# Altium schematic sheet wifi.SchDoc
size A
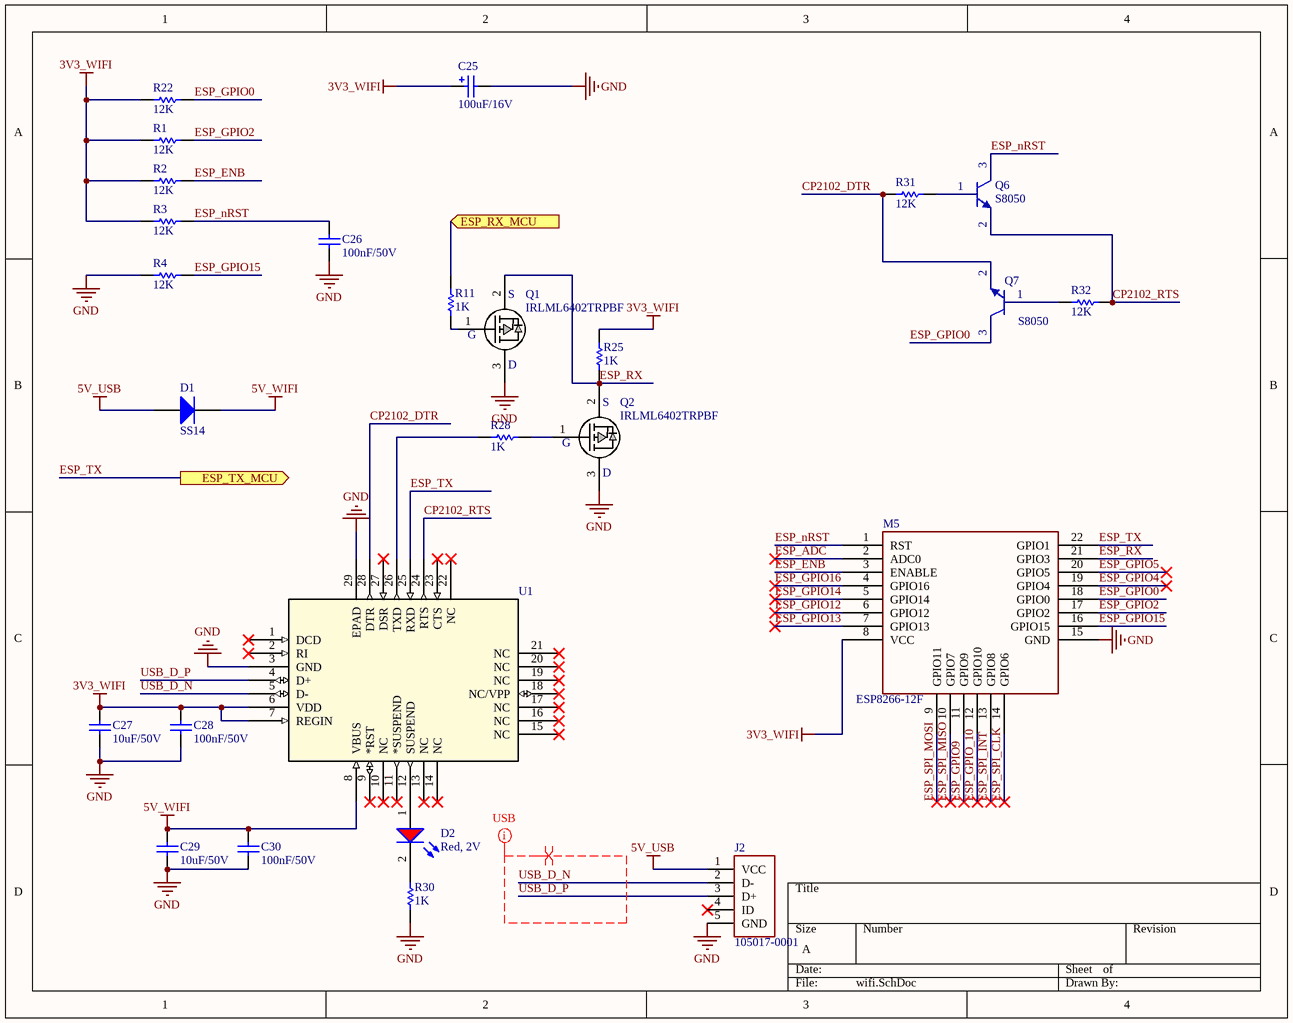
[diagram p0: wifi.SchDoc]

## Parts
C25  value 100uF/16V  [CAP_SM_TAN]  (hidden comment: TAJB107M006RNJ)
C26  value 100nF/50V  [CAP-SM-0805]  (hidden comment: Cap-100nF-50V-0805)
C27  value 10uF/50V  [CAP-SM-0805]  (hidden comment: Cap-10uF-50V-0805)
C28  value 100nF/50V  [CAP-SM-0805]  (hidden comment: Cap-100nF-50V-0805)
C29  value 10uF/50V  [CAP-SM-0805]  (hidden comment: Cap-10uF-50V-0805)
C30  value 100nF/50V  [CAP-SM-0805]  (hidden comment: Cap-100nF-50V-0805)
D1  SS14  [SS14]
D2  value Red, 2V  [LED_0805_Blue]  (hidden comment: LED-RED-TH-3mm)
J2  105017-0001  [CONN_105017-0001]
M5  ESP8266-12F  [ESP8266-12F]
Q1  IRLML6402TRPBF  [SOT23_NEX]
Q2  IRLML6402TRPBF  [SOT23_NEX]
Q6  S8050  [SOT23_NEX]
Q7  S8050  [SOT23_NEX]
R1  value 12K  [RES-SM-0805]  (hidden comment: Res-12K-0805)
R2  value 12K  [RES-SM-0805]  (hidden comment: Res-12K-0805)
R3  value 12K  [RES-SM-0805]  (hidden comment: Res-12K-0805)
R4  value 12K  [RES-SM-0805]  (hidden comment: Res-12K-0805)
R11  value 1K  [RES-SM-0805]  (hidden comment: Res-1K-0805)
R22  value 12K  [RES-SM-0805]  (hidden comment: Res-12K-0805)
R25  value 1K  [RES-SM-0805]  (hidden comment: Res-1K-0805)
R28  value 1K  [RES-SM-0805]  (hidden comment: Res-1K-0805)
R30  value 1K  [RES-SM-0805]  (hidden comment: Res-1K-0805)
R31  value 12K  [RES-SM-0805]  (hidden comment: Res-12K-0805)
R32  value 12K  [RES-SM-0805]  (hidden comment: Res-12K-0805)
U1  (no value)  [CP2102-GM]

## Ports
ESP_RX_MCU (in), ESP_TX_MCU (out)

## Nets
3V3_WIFI: C25.1 C27.2 C28.2 M5.8(VCC) R1.1 R2.1 R3.1 R22.1 R25.1 U1.6(VDD) U1.7(REGIN)
5V_USB: D1.2(A) J2.1(VCC)
5V_WIFI: C29.2 C30.2 D1.1(K) U1.8(VBUS)
GND: C25.2 C26.1 C27.1 C28.1 C29.1 C30.1 J2.5(GND) M5.15(GND) Q1.3(D) Q2.3(D) R4.1 R30.1 U1.3(GND) U1.29(EPAD)
CP2102_DTR: Q7.2(E) R31.1 U1.28(DTR)
CP2102_RTS: Q6.2(E) R32.2 U1.24(RTS)
ESP_ADC: M5.2(ADC0)
ESP_ENB: M5.3(ENABLE) R2.2
ESP_GPIO0: M5.18(GPIO0) Q7.3(C) R22.2
ESP_GPIO2: M5.17(GPIO2) R1.2
ESP_GPIO4: M5.19(GPIO4)
ESP_GPIO5: M5.20(GPIO5)
ESP_GPIO9: M5.11(GPIO9)
ESP_GPIO12: M5.6(GPIO12)
ESP_GPIO13: M5.7(GPIO13)
ESP_GPIO14: M5.5(GPIO14)
ESP_GPIO15: M5.16(GPIO15) R4.2
ESP_GPIO16: M5.4(GPIO16)
ESP_GPIO_10: M5.12(GPIO10)
ESP_nRST: C26.2 M5.1(RST) Q6.3(C) R3.2
ESP_RX: M5.21(GPIO3) Q1.2(S) Q2.2(S) R25.2
ESP_RX_MCU: R11.2 ; port ESP_RX_MCU
ESP_SPI_CLK: M5.14(GPIO6)
ESP_SPI_INT: M5.13(GPIO8)
ESP_SPI_MISO: M5.10(GPIO7)
ESP_SPI_MOSI: M5.9(GPIO11)
ESP_TX: M5.22(GPIO1) U1.25(RXD) ; port ESP_TX_MCU
USB_D_N: J2.2(D-) U1.5(D-)
USB_D_P: J2.3(D+) U1.4(D+)
NetD2_1: D2.1(A) U1.12(SUSPEND)
NetD2_2: D2.2(K) R30.2
NetQ1_1: Q1.1(G) R11.1
NetQ2_1: Q2.1(G) R28.2
NetQ6_1: Q6.1(B) R31.2
NetQ7_1: Q7.1(B) R32.1
NetR28_1: R28.1 U1.26(TXD)

Not connected (* = marked no-connect by the designer): J2 4(ID)*; U1 1(DCD)* 2(RI)* 9(*RST)* 10(NC)* 11(*SUSPEND)* 13(NC)* 14(NC)* 15(NC)* 16(NC)* 17(NC)* 18(NC/VPP)* 19(NC)* 20(NC)* 21(NC)* 22(NC)* 23(CTS)* 27(DSR)*

## Layout directives
net class USB: USB_D_N, USB_D_P
differential pair: USB_D_N, USB_D_P

## Library data of the parts
C25 = Cap-Tan-100uF-16V: Manufacturer: Nichicon; Manufacturer Part Number: UWX1C101MCL1GB; Local Supplier: icdayroi; Local Supplier Link: https://icdayroi.com/tu-tantalum-100uf-16v-smd6032; Supplier 1: Digikey; Supplier 1 Part Number: 493-2105-1-ND; Supplier 1 Link: https://www.digikey.com/product-detail/en/nichicon/UWX1C101MCL1GB/493-2105-1-ND/590080
C26 C28 C30 = Cap-100nF-50V-0805: CAP CER 0.1UF 50V Y5V 0805; Manufacturer: Samsung Electro-Mechanics; Manufacturer Part Number: CL21F104ZBCNNNC; Local Supplier: thegioiic; Local Supplier Link: https://thegioiic.com/products/tu-100nf-0-1uf-50v-0805; Supplier 1: Digikey; Supplier 1 Part Number: 1276-1007-1-ND; Supplier 1 Link: https://www.digikey.com/product-detail/en/samsung-electro-mechanics/CL21F104ZBCNNNC/1276-1007-1-ND/3889093
C27 C29 = Cap-10uF-50V-0805: CAP CER 10UF 50V X5R 0805; Manufacturer: Yageo; Manufacturer Part Number: CC0805KKX5R9BB106; Local Supplier: thegioiic; Local Supplier Link: https://thegioiic.com/products/tu-10uf-50v-0805; Supplier 1: Digikey; Supplier 1 Link: https://www.digikey.com/product-detail/en/yageo/CC0805KKX5R9BB106/311-3499-2-ND/7164383; Supplier 1 Part Number: 311-3499-2-ND
D1 = Diode-SS14: DIODE SCHOTTKY 40V 1A SMA; Manufacturer: ON Semiconductor; Local Supplier: thegioiic; Local Supplier Link: https://thegioiic.com/products/ss14-sma; Supplier 1: Digikey; Supplier 1 Link: https://www.digikey.com/product-detail/en/on-semiconductor/SS14/SS14CT-ND/965729; Manufacturer Part Number: SS14; Supplier 1 Part Number: SS14CT-ND
D2 = LED-RED-TH-3mm: LED RED CLEAR T-1 T/H; Manufacturer: Kingbright; Manufacturer Part Number: WP710A10SEC/J3; Local Supplier: thegioiic; Local Supplier Link: https://thegioiic.com/products/led-do-3mm-chan-dai; Supplier 1: Digikey; Supplier 1 Link: https://www.digikey.com/product-detail/en/kingbright/WP710A10SEC-J3/754-1589-ND/2769815; Supplier 1 Part Number: 754-1589-ND
J2 = 105017-0001: No Description Available; Vendor: Molex Connector Corporation; Built_By: EMA_Cory; SourceLibrary: Molex_2020-05-26; Datasheet: https://www.molex.com/pdm_docs/sd/1050170001_sd.pdf; Manufacturer_Part_Number: 105017-0001; Copyright: Copyright (C) 2018 Accelerated Designs. All rights reserved; RefDes: RefDes; Type: DEV
Q1 Q2 = IRLML6402TRPBF: P-Channel 20V 3.7A (Ta) 1.3W (Ta) Surface Mount Micro3™/SOT-23
R1-R4 R22 R31 R32 = Res-12K-0805: RES 12 KOHM JUMPER 0805; Manufacturer: Vishay Thin Film; Manufacturer Part Number: PAT0805E3121BST1; Local Supplier: icdayroi; Local Supplier Link: https://icdayroi.com/dien-tro-12k-0805-1-goi-50-con; Supplier 1: Digikey; Supplier 1 Link: https://www.digikey.com/product-detail/en/vishay-thin-film/PAT0805E3121BST1/PAT0805E3121BST1-ND/2281536; Supplier 1 Part Number: PAT0805E3121BST1-ND
R11 R25 R28 R30 = Res-1K-0805: RES 1K OHM 1% 1/4W 0805; Manufacturer: Stackpole Electronics Inc; Manufacturer Part Number: RNCP0805FTD1K00; Local Supplier: thegioiic; Local Supplier Link: https://thegioiic.com/products/dien-tro-1k-ohm-0805-5; Supplier 1: Digikey; Supplier 1 Link: https://www.digikey.com/product-detail/en/stackpole-electronics-inc/RNCP0805FTD1K00/RNCP0805FTD1K00CT-ND/2240568; Supplier 1 Part Number: RNCP0805FTD1K00CT-ND
U1 = CP2102-GM: No Description Available; Vendor: Silicon Labs; Built_By: EMA_UL_Team; SourceLibrary: Silicon_Labs_2015-03-23; Manufacturer_Part_Number: CP2102-GM; Copyright: Copyright (C) 2018 Accelerated Designs. All rights reserved; RefDes: RefDes; Type: DEV
M5 = ESP8266-12F: Local Supplier: HShop; Local Supplier Link: https://hshop.vn/products/mach-thu-phat-wifi-soc-esp8266-v12; Local Supplier Part Number: HS000912; Manufacturer: *; Manufacturer Part Number: *